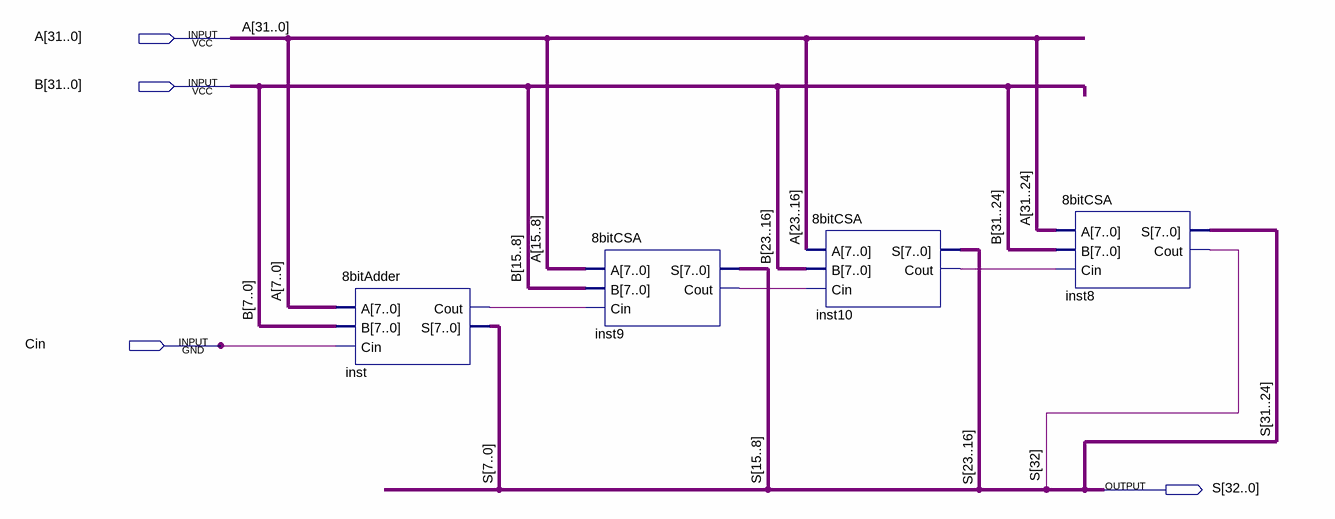
[diagram p0: schematic sheet]
// Quartus schematic 32bitCSA.bdf as structural Verilog: 4 symbols, 4 pins
module \32bitCSA  (
  input  [31:0] A,
  input  [31:0] B,
  input  Cin,
  output [32:0] S
);

  wire inst9_cout, inst10_cout, inst_cout;

  \8bitAdder  inst (.A(A[7:0]), .B(B[7:0]), .Cin(Cin), .Cout(inst_cout), .S(S[7:0]));
  \8bitCSA  inst9 (.A(A[15:8]), .B(B[15:8]), .Cin(inst_cout), .S(S[15:8]), .Cout(inst9_cout));
  \8bitCSA  inst10 (.A(A[23:16]), .B(B[23:16]), .Cin(inst9_cout), .S(S[23:16]), .Cout(inst10_cout));
  \8bitCSA  inst8 (.A(A[31:24]), .B(B[31:24]), .Cin(inst10_cout), .S(S[31:24]), .Cout(S[32]));
endmodule
